# Altium schematic sheet Inputbuffer_Equalizer.SchDoc
size A; DocumentNumber: 1; SheetNumber: 1; SheetTotal: 5
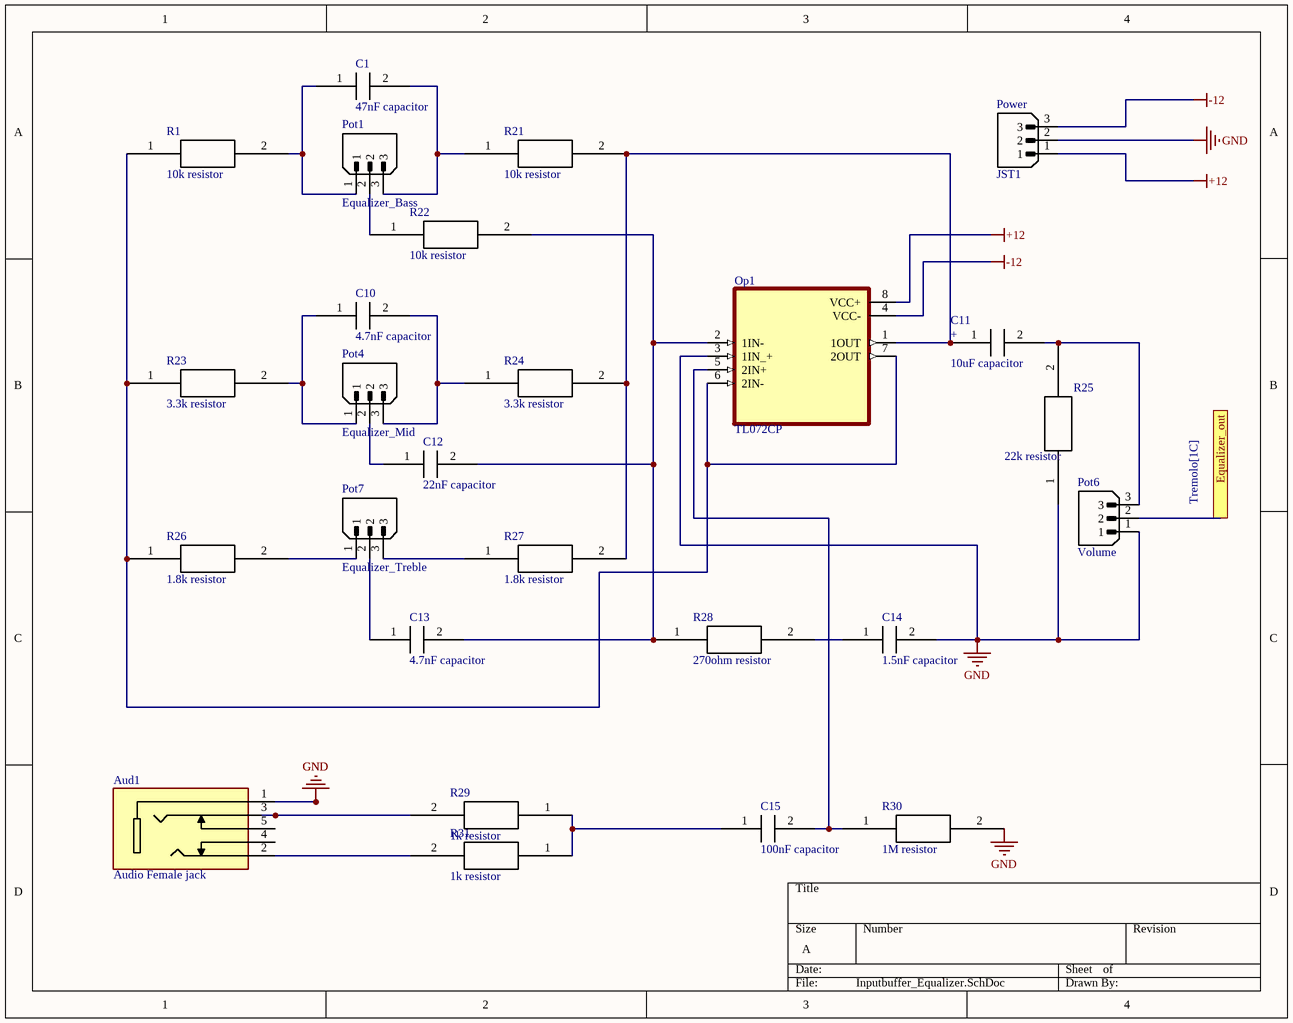
[diagram p0: Inputbuffer_Equalizer.SchDoc]

## Parts
Aud1  Audio Female jack  [Audio Female Jack]
C1  47nF capacitor  [47nF]
C10  4.7nF capacitor  [4.7nF]
C11  10uF capacitor  [10uF]
C12  22nF capacitor  [22nF]
C13  4.7nF capacitor  [4.7nF]
C14  1.5nF capacitor  [1.5nF]
C15  100nF capacitor  [100nF]
JST1  Power  [3pin_jst]
Op1  TL072CP  [TL072CP]
Pot1  Equalizer_Bass  [3pin_jst]
Pot4  Equalizer_Mid  [3pin_jst]
Pot6  Volume  [3pin_jst]
Pot7  Equalizer_Treble  [3pin_jst]
R1  10k resistor  [10k]
R21  10k resistor  [10k]
R22  10k resistor  [10k]
R23  3.3k resistor  [3.3k]
R24  3.3k resistor  [3.3k]
R25  22k resistor  [22k]
R26  1.8k resistor  [1.8k]
R27  1.8k resistor  [1.8k]
R28  270ohm resistor  [270]
R29  1k resistor  [1k]
R30  1M resistor  [1M]
R31  1k resistor  [1k]

## Ports
Equalizer_out (see Tremolo[1C])

## Nets
+12: JST1.1 Op1.8(VCC+)
-12: JST1.3 Op1.4(VCC-)
GND: Aud1.1 C14.2 JST1.2 Op1.3(1IN_+) Pot6.1 R25.1 R30.2
Equalizer_out: Pot6.2 ; port Equalizer_out
NetAud1_2: Aud1.2 R31.2
NetAud1_3: Aud1.3 R29.2
NetC1_1: C1.1 Pot1.1 R1.2
NetC1_2: C1.2 Pot1.3 R21.1
NetC10_1: C10.1 Pot4.1 R23.2
NetC10_2: C10.2 Pot4.3 R24.1
NetC11_1: C11.1 Op1.1(1OUT) R21.2 R24.2 R27.2
NetC11_2: C11.2 Pot6.3 R25.2
NetC12_1: C12.1 Pot4.2
NetC12_2: C12.2 C13.2 Op1.2(1IN-) R22.2 R28.1
NetC13_1: C13.1 Pot7.2
NetC14_1: C14.1 R28.2
NetC15_1: C15.1 R29.1 R31.1
NetC15_2: C15.2 Op1.5(2IN+) R30.1
NetOp1_6: Op1.6(2IN-) Op1.7(2OUT) R1.1 R23.1 R26.1
NetPot1_2: Pot1.2 R22.1
NetPot7_1: Pot7.1 R26.2
NetPot7_3: Pot7.3 R27.1

Not connected (* = marked no-connect by the designer): Aud1 4 5

## Notes on the sheet
- (in symbol 10uF capacitor) +

## Library data of the parts
JST1 Pot1 Pot4 Pot6 Pot7 = 3pin_jst